# Altium schematic sheet vreg.SchDoc
size A
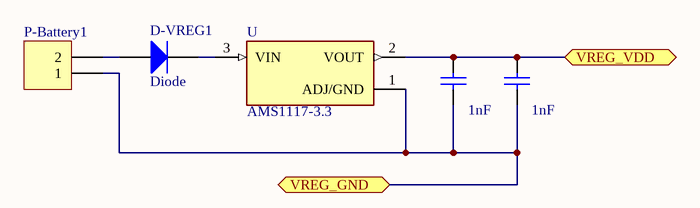
[diagram p0: vreg.SchDoc]

## Parts
C-VREG1  value 1nF  [RAD-0.3]  (hidden comment: Cap)
C-VREG2  value 1nF  [RAD-0.3]  (hidden comment: Cap)
D-VREG1  Diode  [SMC]
P-Battery1  Header 2  [HDR1X2]  (value not drawn)
U  AMS1117-3.3  [SOT229P700X180-4N]

## Ports
VREG_GND, VREG_VDD

## Nets
VREG_GND: C-VREG1.1 C-VREG2.1 P-Battery1.1 U.1(ADJ/GND) ; port VREG_GND
VREG_VDD: C-VREG1.2 C-VREG2.2 U.2(VOUT) ; port VREG_VDD
NetD-VREG1_1: D-VREG1.1(A) P-Battery1.2
NetD-VREG1_2: D-VREG1.2(K) U.3(VIN)

## Library data of the parts
C-VREG1 C-VREG2 = Cap: Capacitor; Published: 8-Jun-2000; LatestRevisionDate: 17-Jul-2002; LatestRevisionNote: Re-released for DXP Platform.; PackageReference: RAD-0.3; Publisher: Altium Limited; PackageDescription: Radial Cap, Thru-Hole; 2 Leads; 0.3 in Pin Spacing
D-VREG1 = Diode: Default Diode; Published: 8-Jun-2000; LatestRevisionDate: 17-Jul-2002; LatestRevisionNote: Re-released for DXP Platform.; PackageVersion: Sep-1996; PackageReference: SMC; Publisher: Altium Limited; PackageDescription: DO-214-AB/SMC; 2 C-Bend Leads; Body 7.9 x 5.9 mm, inc. leads (LxW); Code_JEDEC: DO-214-AB
P-Battery1 = Header 2: Header, 2-Pin; LatestRevisionDate: 17-Jul-2002; LatestRevisionNote: Re-released for DXP Platform.; Publisher: Altium Limited
U = AMS1117-3.3: Sot223/Pkg 1-Amp 3.3-Volt Low Drop Out Voltage Regulatator; MF: Advanced Monolithic Systems; Price: None; Package: None; Value: *; MP: AMS1117-3.3; Availability: Unavailable; SnapEDA_Link: https://www.snapeda.com/parts/AMS1117-3.3/Advanced%20Monolithic%20Systems/view-part/53450/?ref=snap